# EAGLE schematic ATtiny85 Temperature Sensor (EAGLE 7.4.0)
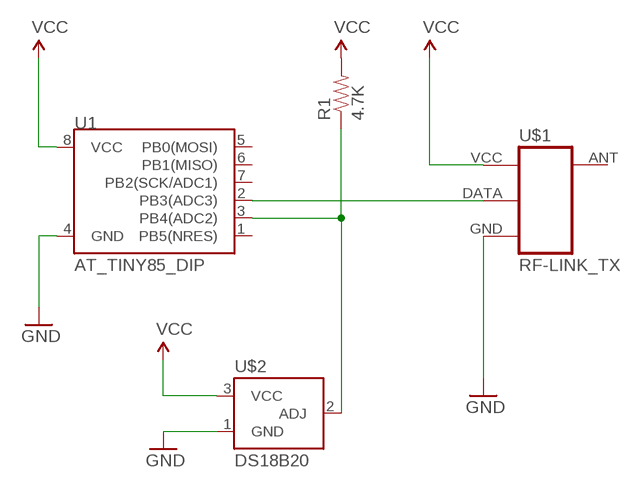
[diagram p0: schematic, sheet 1]

## Parts
R1  4.7K  RESISTORAXIAL-0.3  [AXIAL-0.3]
U1  AT_TINY85_DIP  ATTINY45TINY45-20-DIP  [DIP08]
U$1  RF-LINK_TX  [RF-LINK_TX]
U$2  DS18B20  TEMPERATURE-SENSOR  [TO-92]

## Nets
GND: U1.4(GND) U$1.GND U$2.1(GND)
N$1: U1.2(PB3(ADC3)) U$1.DATA
N$2: R1.P$1 U1.3(PB4(ADC2)) U$2.2(ADJ)
VCC: R1.P$2 U1.8(VCC) U$1.VCC(+5V) U$2.3(VCC)
Unconnected: U1.1(PB5(NRES)) U1.5(PB0(MOSI)) U1.6(PB1(MISO)) U1.7(PB2(SCK/ADC1)) U$1.ANT

## Library data of the parts
R1 = SparkFun-Passives:RESISTOR: Resistor Basic schematic elements and footprints for 0603, 1206, and PTH resistors.
U1 = SparkFun-DigitalIC:ATTINY45: Atmel 8-pin 2/4/8kB flash uC; PROD_ID: IC-09439; VALUE: TINY45-20-DIP
U$1 = SparkFun-RF:RF-LINK_TX: RF Link transmitters WRL-8945, 8946
U$2 = SparkFun-Sensors:TEMPERATURE-SENSOR: TO-92 temp sensor